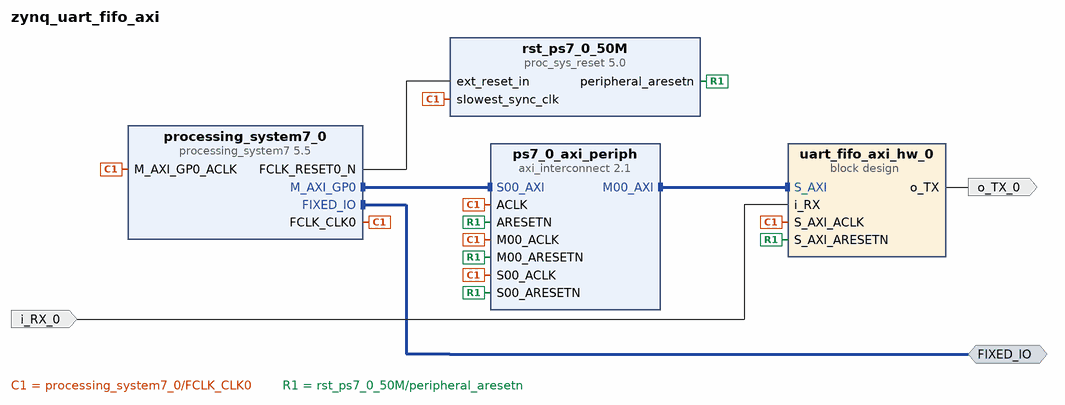
[diagram p0: block diagram of the top level]
# Vivado block design zynq_uart_fifo_axi, xc7z020clg400-1, Vivado 2023.2
create_bd_design zynq_uart_fifo_axi

create_bd_intf_port -mode Master -vlnv xilinx.com:display_processing_system7:fixedio_rtl:1.0 FIXED_IO
create_bd_port -dir O o_TX_0
create_bd_port -dir I i_RX_0

create_bd_cell -type ip -vlnv xilinx.com:ip:processing_system7:5.5 processing_system7_0
set_property -dict [list \
  CONFIG.PCW_UART1_PERIPHERAL_ENABLE 1 \
  CONFIG.PCW_UART1_UART1_IO {MIO 48 .. 49} \
  CONFIG.PCW_UART_PERIPHERAL_FREQMHZ 100 \
  CONFIG.PCW_UIPARAM_DDR_ENABLE 0 \
] [get_bd_cells processing_system7_0]
# 42 more settings of processing_system7_0 are not shown: defaults, MIO pin electricals, DDR timing, and values the tool derives
create_bd_cell -type container -reference uart_fifo_axi_hw uart_fifo_axi_hw_0
set_property -dict [list \
  CONFIG.ACTIVE_SIM_BD uart_fifo_axi_hw.bd \
  CONFIG.ACTIVE_SYNTH_BD uart_fifo_axi_hw.bd \
  CONFIG.ENABLE_DFX 0 \
  CONFIG.LIST_SIM_BD uart_fifo_axi_hw.bd \
  CONFIG.LIST_SYNTH_BD uart_fifo_axi_hw.bd \
  CONFIG.LOCK_PROPAGATE 0 \
] [get_bd_cells uart_fifo_axi_hw_0]
create_bd_cell -type ip -vlnv xilinx.com:ip:axi_interconnect:2.1 ps7_0_axi_periph
set_property -dict {CONFIG.NUM_MI 1} [get_bd_cells ps7_0_axi_periph]
create_bd_cell -type ip -vlnv xilinx.com:ip:proc_sys_reset:5.0 rst_ps7_0_50M

# ---- connections ----

connect_bd_intf_net [get_bd_intf_ports FIXED_IO] [get_bd_intf_pins processing_system7_0/FIXED_IO]
connect_bd_intf_net [get_bd_intf_pins processing_system7_0/M_AXI_GP0] [get_bd_intf_pins ps7_0_axi_periph/S00_AXI]
connect_bd_intf_net [get_bd_intf_pins ps7_0_axi_periph/M00_AXI] [get_bd_intf_pins uart_fifo_axi_hw_0/S_AXI]
connect_bd_net -net i_RX_0_1 [get_bd_ports i_RX_0] [get_bd_pins uart_fifo_axi_hw_0/i_RX]
connect_bd_net [get_bd_pins processing_system7_0/FCLK_CLK0] \
  [get_bd_pins processing_system7_0/M_AXI_GP0_ACLK] [get_bd_pins ps7_0_axi_periph/S00_ACLK] \
  [get_bd_pins rst_ps7_0_50M/slowest_sync_clk] [get_bd_pins uart_fifo_axi_hw_0/S_AXI_ACLK] \
  [get_bd_pins ps7_0_axi_periph/M00_ACLK] [get_bd_pins ps7_0_axi_periph/ACLK]
connect_bd_net [get_bd_pins processing_system7_0/FCLK_RESET0_N] [get_bd_pins rst_ps7_0_50M/ext_reset_in]
connect_bd_net [get_bd_pins rst_ps7_0_50M/peripheral_aresetn] \
  [get_bd_pins ps7_0_axi_periph/S00_ARESETN] [get_bd_pins ps7_0_axi_periph/M00_ARESETN] \
  [get_bd_pins ps7_0_axi_periph/ARESETN] [get_bd_pins uart_fifo_axi_hw_0/S_AXI_ARESETN]
connect_bd_net [get_bd_pins uart_fifo_axi_hw_0/o_TX] [get_bd_ports o_TX_0]

# ---- address map ----
assign_bd_address -offset 0x40000000 -range 4K -target_address_space [get_bd_addr_spaces processing_system7_0/Data] [get_bd_addr_segs uart_fifo_axi_hw_0/axi_lite_slave/S_AXI/reg0]

validate_bd_design
save_bd_design
